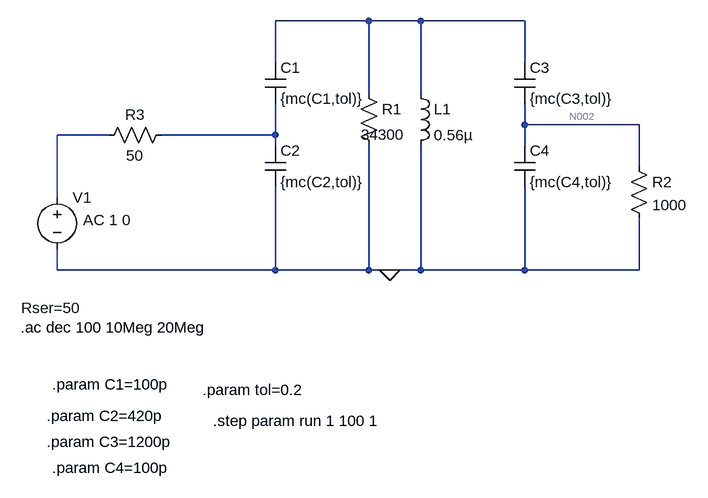
[diagram p0: schematic Simulacion.asc]
Simulacion.asc, the LTspice schematic file:
Version 4
SHEET 1 880 704
WIRE 240 0 96 0
WIRE 320 0 240 0
WIRE 480 0 320 0
WIRE 96 64 96 0
WIRE 480 64 480 0
WIRE 240 112 240 0
WIRE 320 112 320 0
WIRE 480 160 480 128
WIRE 656 160 480 160
WIRE -160 176 -240 176
WIRE 96 176 96 128
WIRE 96 176 -80 176
WIRE 96 192 96 176
WIRE 480 192 480 160
WIRE 656 224 656 160
WIRE -240 272 -240 176
WIRE -240 384 -240 352
WIRE 96 384 96 256
WIRE 96 384 -240 384
WIRE 240 384 240 192
WIRE 240 384 96 384
WIRE 272 384 240 384
WIRE 320 384 320 192
WIRE 320 384 272 384
WIRE 480 384 480 256
WIRE 480 384 320 384
WIRE 656 384 656 304
WIRE 656 384 480 384
FLAG 272 384 0
SYMBOL ind 304 96 R0
SYMATTR InstName L1
SYMATTR Value 0.56µ
SYMATTR SpiceLine Rpar=0
SYMBOL cap 80 64 R0
SYMATTR InstName C1
SYMATTR Value {mc(C1,tol)}
SYMBOL cap 80 192 R0
SYMATTR InstName C2
SYMATTR Value {mc(C2,tol)}
SYMBOL cap 464 64 R0
SYMATTR InstName C3
SYMATTR Value {mc(C3,tol)}
SYMBOL cap 464 192 R0
SYMATTR InstName C4
SYMATTR Value {mc(C4,tol)}
SYMBOL res 224 96 R0
WINDOW 3 4 79 Left 2
SYMATTR Value 34300
SYMATTR InstName R1
SYMBOL res 640 208 R0
SYMATTR InstName R2
SYMATTR Value 1000
SYMBOL res -64 160 R90
WINDOW 0 0 56 VBottom 2
WINDOW 3 32 56 VTop 2
SYMATTR InstName R3
SYMATTR Value 50
SYMBOL voltage -240 256 R0
WINDOW 123 40 51 Left 2
WINDOW 39 -55 186 Left 2
SYMATTR Value2 AC 1 0
SYMATTR SpiceLine Rser=50
SYMATTR InstName V1
SYMATTR Value ""
TEXT -296 472 Left 2 !.ac dec 100 10Meg 20Meg
TEXT -248 560 Left 2 !.param C1=100p
TEXT -256 608 Left 2 !.param C2=420p
TEXT -256 648 Left 2 !.param C3=1200p
TEXT -248 688 Left 2 !.param C4=100p
TEXT -16 568 Left 2 !.param tol=0.2
TEXT 0 616 Left 2 !.step param run 1 100 1

The netlist it stands for:
* Simulacion.asc
L1 N001 0 0.56µ Rpar=0
C1 N001 N004 {mc(C1,tol)}
C2 N004 0 {mc(C2,tol)}
C3 N001 N002 {mc(C3,tol)}
C4 N002 0 {mc(C4,tol)}
R1 N001 0 34300
R2 N002 0 1000
R3 N004 N003 50
V1 N003 0 AC 1 0 Rser=50
.ac dec 100 10Meg 20Meg
.param C1=100p
.param C2=420p
.param C3=1200p
.param C4=100p
.param tol=0.2
.step param run 1 100 1
.backanno
.end

* Results of the author's LTspice run, read from the files saved beside the schematic
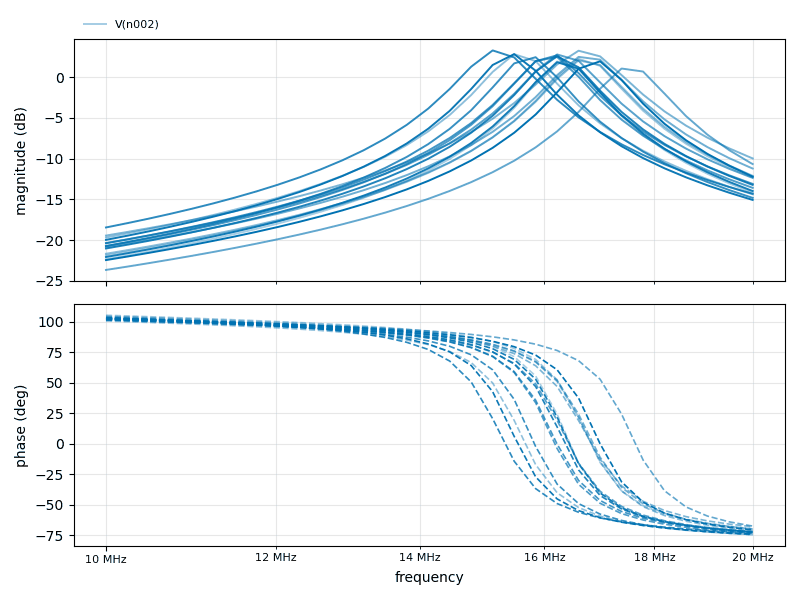
[diagram p1: AC Analysis of Simulacion.asc, plotted from the saved traces]
* AC Analysis, 100 runs:
*   V(n002) [run 1]: -22.37 dB at 10 MHz, -14.17 dB at 20 MHz, peak 1.95 dB at 16.22 MHz, 3 dB below the peak at 15.81 MHz and 16.88 MHz
*   V(n002) [run 2]: -21.88 dB at 10 MHz, -12.29 dB at 20 MHz, peak 2.26 dB at 16.6 MHz, 3 dB below the peak at 16.12 MHz and 17.29 MHz
*   V(n002) [run 3]: -19.69 dB at 10 MHz, -14.38 dB at 20 MHz, peak 2.85 dB at 15.49 MHz, 3 dB below the peak at 15.03 MHz and 16.14 MHz
*   V(n002) [run 4]: -21.68 dB at 10 MHz, -12.10 dB at 20 MHz, peak 2.09 dB at 16.6 MHz, 3 dB below the peak at 16.12 MHz and 17.34 MHz
*   V(n002) [run 5]: -19.45 dB at 10 MHz, -9.97 dB at 20 MHz, peak 3.27 dB at 16.6 MHz, 3 dB below the peak at 16.02 MHz and 17.38 MHz
*   V(n002) [run 6]: -20.91 dB at 10 MHz, -11.21 dB at 20 MHz, peak 2.51 dB at 16.6 MHz, 3 dB below the peak at 16.11 MHz and 17.4 MHz
*   V(n002) [run 7]: -23.67 dB at 10 MHz, -10.66 dB at 20 MHz, peak 1.08 dB at 17.38 MHz, 3 dB below the peak at 16.91 MHz and 18.19 MHz
*   V(n002) [run 8]: -20.38 dB at 10 MHz, -12.36 dB at 20 MHz, peak 2.81 dB at 16.22 MHz, 3 dB below the peak at 15.73 MHz and 16.92 MHz